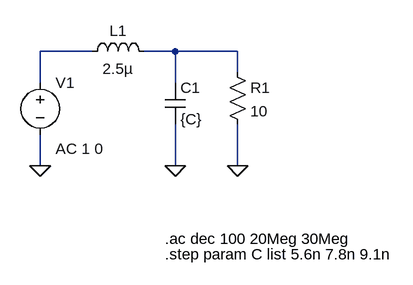
[diagram p0: schematic simple_rlc.asc]
simple_rlc.asc, the LTspice schematic file:
Version 4
SHEET 1 880 680
WIRE 384 176 304 176
WIRE 512 176 464 176
WIRE 608 176 512 176
WIRE 608 208 608 176
WIRE 304 224 304 176
WIRE 512 224 512 176
WIRE 304 352 304 304
WIRE 512 352 512 288
WIRE 608 352 608 288
FLAG 304 352 0
FLAG 512 352 0
FLAG 608 352 0
SYMBOL voltage 304 208 R0
WINDOW 123 24 118 Left 2
SYMATTR InstName V1
SYMATTR Value ""
SYMATTR Value2 AC 1 0
SYMBOL ind 368 192 R270
WINDOW 0 32 56 VTop 2
WINDOW 3 5 56 VBottom 2
SYMATTR InstName L1
SYMATTR Value 2.5µ
SYMBOL cap 496 224 R0
SYMATTR InstName C1
SYMATTR Value {C}
SYMBOL res 592 192 R0
SYMATTR InstName R1
SYMATTR Value 10
TEXT 496 464 Left 2 !.ac dec 100 20Meg 30Meg
TEXT 496 488 Left 2 !.step param C list 5.6n 7.8n 9.1n

The netlist it stands for:
* simple_rlc.asc
V1 N001 0 AC 1 0
L1 N001 N002 2.5µ
C1 N002 0 {C}
R1 N002 0 10
.ac dec 100 20Meg 30Meg
.step param C list 5.6n 7.8n 9.1n
.backanno
.end